# EAGLE schematic pearwatch-TOP (EAGLE 9.5.2)
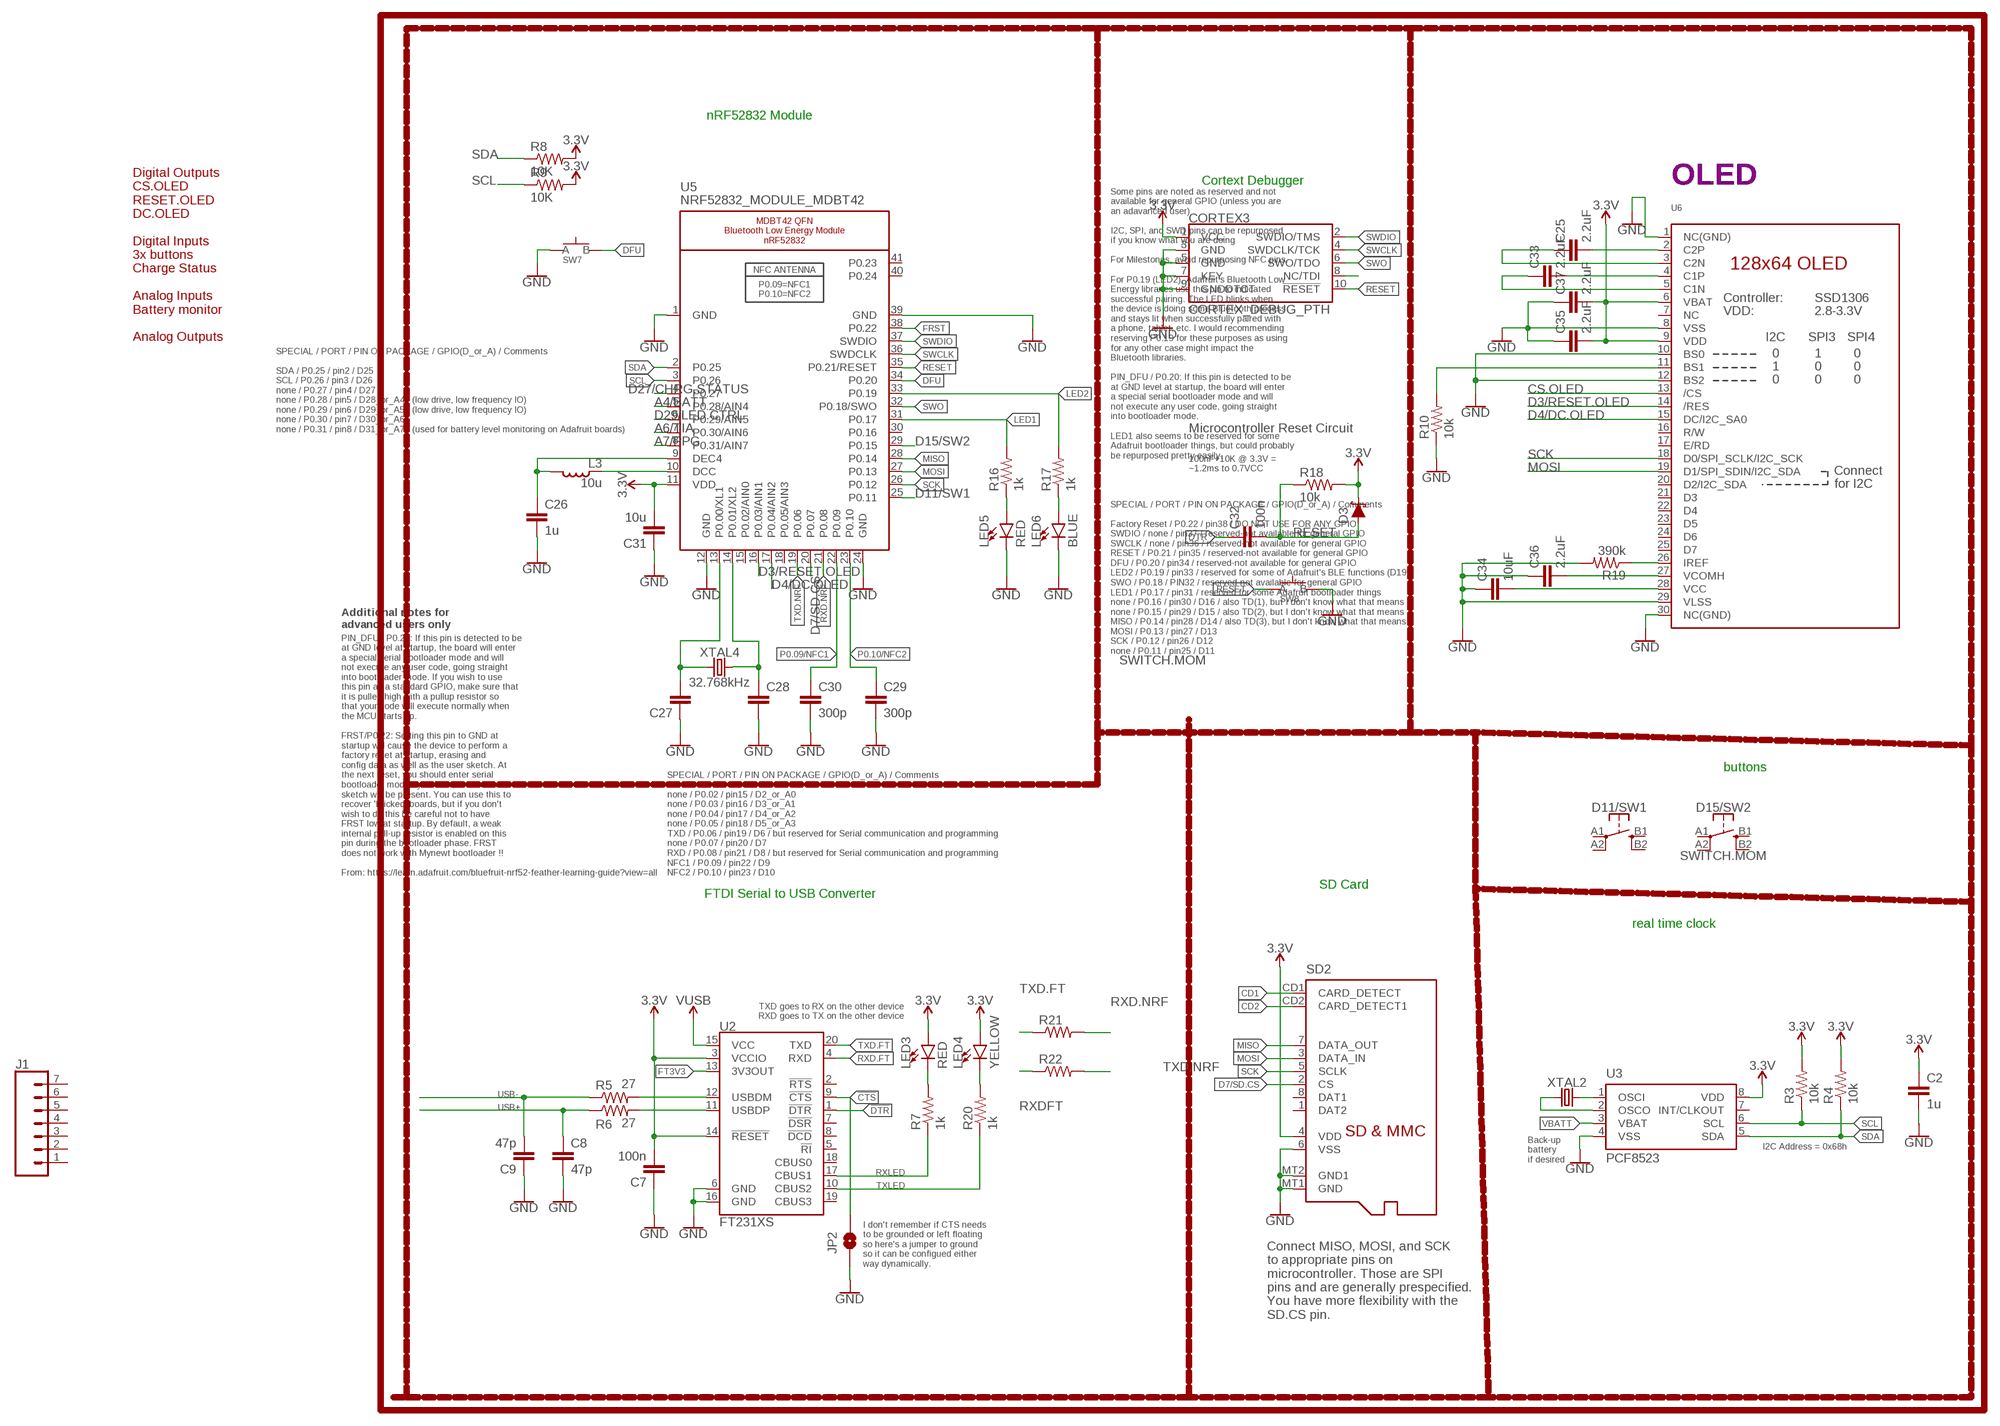
[diagram p0: schematic, sheet 1]

## Parts
C2  1u  CAPACITOR0603  [C0603]
C7  100n  CAPACITOR0603  [C0603]
C8  47p  CAPACITOR0603  [C0603]
C9  47p  CAPACITOR0603  [C0603]
C25  2.2uF  CAPACITOR0402  [C0402]
C26  1u  CAPACITOR0603  [C0603]
C27  CAPACITOR0603  [C0603]
C28  CAPACITOR0603  [C0603]
C29  300p  CAPACITOR0603  [C0603]
C30  300p  CAPACITOR0603  [C0603]
C31  10u  CAPACITOR0805  [C0805]
C32  100n  CAPACITOR0603  [C0603]
C33  2.2uF  CAPACITOR0402  [C0402]
C34  10uF  CAPACITOR0603  [C0603]
C35  2.2uF  CAPACITOR0402  [C0402]
C36  2.2uF  CAPACITOR0402  [C0402]
C37  2.2uF  CAPACITOR0402  [C0402]
CORTEX3  CORTEX_DEBUG_PTH  [2X5-PTH-1.27MM]
D3  SCHOTTKY-USC  [USC]
D11/SW1  SWITCH.MOM  [TACTILE_SWITCH_SMD_6.2MM_TALL]
D15/SW2  SWITCH.MOM  [TACTILE_SWITCH_SMD_6.2MM_TALL]
J1  CONN_07  [1X07]
JP2  JUMPER-SMT_2_NO_SILK  [SMT-JUMPER_2_NO_SILK]
L3  10u  INDUCTOR0603  [L0603]
LED3  RED  LED0603  [LED-0603]
LED4  YELLOW  LED0603  [LED-0603]
LED5  RED  LED0603  [LED-0603]
LED6  BLUE  LED0603  [LED-0603]
R3  10k  RESISTOR0603  [R0603]
R4  10k  RESISTOR0603  [R0603]
R5  27  RESISTOR0603  [R0603]
R6  27  RESISTOR0603  [R0603]
R7  1k  RESISTOR0603  [R0603]
R8  10K  RESISTOR0603  [R0603]
R9  10K  RESISTOR0603  [R0603]
R10  10k  RESISTOR0603  [R0603]
R16  1k  RESISTOR0603  [R0603]
R17  1k  RESISTOR0603  [R0603]
R18  10k  RESISTOR0603  [R0603]
R19  390k  RESISTOR0603  [R0603]
R20  1k  RESISTOR0603  [R0603]
R21  RESISTOR0603  [R0603]
R22  RESISTOR0603  [R0603]
SD2  MICROSD  [MICROSD]
SW7  SPST-PTS830GG140-COPY.1-3  [BUTTON-GULLWING]
SW8  SPST-PTS830GG140-COPY.1-3  [BUTTON-GULLWING]
U2  FT231XS  [SSOP20_L]
U3  PCF8523  [SO8]
U5  NRF52832_MODULE_MDBT42  [BLE_MODULE_RAYTAC_MDBT42]
U6  DISP_OLED_UG-2864HSWEG01-NO-WRAPAROUND  [UG-2864HSWEG01_0.96IN_NO-WRAPAROUND]
XTAL2  32.7680kHz  CRYSTALECS-.327-12.5-12-C-TR  [2-SMD.NOLEAD.2.0MMTO1.2MM]
XTAL4  32.768kHz  CRYSTALECS-.327-12.5-12-C-TR  [2-SMD.NOLEAD.2.0MMTO1.2MM]

## Nets
3.3V: C2.1 C7.2 C31.2 C35.2 C37.2 CORTEX3.1(VCC) D3.-(C) LED3.A LED4.A R3.2 R4.2 R8.2 R9.2 R18.2 SD2.4(VDD) U2.3(VCCIO) U2.14(!RESET) U3.8(VDD) U5.11(VDD) U6.6(VBAT) U6.9(VDD)
!CTS: JP2.2 U2.9(!CTS)
!DTR: U2.1(!DTR)
A4/BATT: U5.5(P0.28/AIN4)
A6/TIA: U5.7(P0.30/AIN6)
A7/PPG: U5.8(P0.31/AIN7)
CD1: SD2.CD1(CARD_DETECT)
CD2: SD2.CD2(CARD_DETECT1)
CS.OLED: U6.13(/CS)
D3/RESET.OLED: U5.16(P0.03/AIN1) U6.14(/RES)
D4/DC.OLED: U5.17(P0.04/AIN2) U6.15(DC/I2C_SA0)
D7/SD.CS: SD2.2(CS) U5.20(P0.07)
D11/SW1: U5.25(P0.11)
D15/SW2: U5.29(P0.15)
D27/CHRG.STATUS: U5.4(P0.27)
D29/LED.CTRL: U5.6(P0.29/AIN5)
DFU: SW7.3(B) U5.34(P0.20)
DTR: C32.1
FRST: U5.38(P0.22)
FT3V3: U2.13(3V3OUT)
GND: C2.2 C7.1 C8.2 C9.1 C26.2 C27.1 C28.2 C29.2 C30.2 C31.1 C34.1 C35.1 C36.1 C37.1 CORTEX3.3(GND) CORTEX3.5(GND) CORTEX3.7(KEY) CORTEX3.9(GNDDTCT) JP2.1 LED5.C LED6.C R10.1 R19.2 SD2.6(VSS) SD2.MT1(GND) SD2.MT2(GND1) SW7.1(A) SW8.3(B) U2.6(GND) U2.16(GND) U3.4(VSS) U5.1(GND) U5.12(GND) U5.24(GND) U5.39(GND) U6.1(NC(GND)) U6.8(VSS) U6.10(BS0) U6.12(BS2) U6.29(VLSS) U6.30(NC(GND))
LED1: R16.2 U5.31(P0.17)
LED2: R17.2 U5.33(P0.19)
MISO: SD2.7(DATA_OUT) U5.28(P0.14)
MOSI: SD2.3(DATA_IN) U5.27(P0.13) U6.19(D1/SPI_SDIN/I2C_SDA)
N$1: U3.2(OSCO) XTAL2.P$1
N$2: U3.1(OSCI) XTAL2.P$2
N$3: R5.2 U2.12(USBDM)
N$6: R6.2 U2.11(USBDP)
N$7: LED3.C R7.2
N$8: LED4.C R20.2
N$18: R10.2 U6.11(BS1)
N$21: R19.1 U6.26(IREF)
N$23: C25.2 U6.2(C2P)
N$26: C27.2 U5.13(P0.00/XL1) XTAL4.P$1
N$27: C28.1 U5.14(P0.01/XL2) XTAL4.P$2
N$28: LED5.A R16.1
N$29: LED6.A R17.1
N$30: L3.1 U5.10(DCC)
N$31: C26.1 L3.2 U5.9(DEC4)
N$32: CORTEX3.8(NC/TDI)
N$33: C25.1 U6.3(C2N)
N$34: C33.2 U6.4(C1P)
N$35: C33.1 U6.5(C1N)
N$36: C34.2 U6.28(VCC)
N$37: C36.2 U6.27(VCOMH)
P0.09/NFC1: C30.1 U5.22(P0.09)
P0.10/NFC2: C29.1 U5.23(P0.10)
RESET: C32.2 CORTEX3.10(!RESET) D3.+(A) R18.1 SW8.1(A) U5.35(P0.21/RESET)
RXD.FT: U2.4(RXD)
RXD.NRF: R21.2 U5.21(P0.08)
RXDFT: R22.1
RXLED: R7.1 U2.17(CBUS1)
SCK: SD2.5(SCLK) U5.26(P0.12) U6.18(D0/SPI_SCLK/I2C_SCK)
SCL: R3.1 R9.1 U3.6(SCL) U5.3(P0.26)
SDA: R4.1 R8.1 U3.5(SDA) U5.2(P0.25)
SWCLK: CORTEX3.4(SWDCLK/TCK) U5.36(SWDCLK)
SWDIO: CORTEX3.2(SWDIO/TMS) U5.37(SWDIO)
SWO: CORTEX3.6(SWO/TDO) U5.32(P0.18/SWO)
TXD.FT: R21.1 U2.20(TXD)
TXD.NRF: R22.2 U5.19(P0.06)
TXLED: R20.1 U2.10(CBUS2)
USB+: C8.1 R6.1
USB-: C9.2 R5.1
V_USB: U2.15(VCC) ; supply symbol labelled VUSB
VBATT: U3.3(VBAT)
Unconnected: D11/SW1.A1 D11/SW1.A2 D11/SW1.B1 D11/SW1.B2 D15/SW2.A1 D15/SW2.A2 D15/SW2.B1 D15/SW2.B2 J1.1 J1.2 J1.3 J1.4 J1.5 J1.6 J1.7 SD2.1(DAT2) SD2.8(DAT1) U2.2(!RTS) U2.5(!RI) U2.7(!DSR) U2.8(!DCD) U2.18(CBUS0) U2.19(CBUS3) U3.7(INT/CLKOUT) U5.15(P0.02/AIN0) U5.18(P0.05/AIN3) U5.30(P0.16) U5.40(P0.24) U5.41(P0.23) U6.7(NC) U6.16(R/W) U6.17(E/RD) U6.20(D2/I2C_SDA) U6.21(D3) U6.22(D4) U6.23(D5) U6.24(D6) U6.25(D7)

## Notes on the sheet
- nRF52832 Module
- Cortext Debugger | OLED
- Digital Outputs
  CS.OLED 
  RESET.OLED 
  DC.OLED
  
  Digital Inputs
  3x buttons
  Charge Status
  
  Analog Inputs
  Battery monitor
  
  Analog Outputs
- SPECIAL / PORT / PIN ON PACKAGE / GPIO(D_or_A) / Comments
  
  SDA / P0.25 / pin2 / D25
  SCL / P0.26 / pin3 / D26
  none / P0.27 / pin4 / D27
  none / P0.28 / pin5 / D28_or_A4 / (low drive, low frequency IO)
  none / P0.29 / pin6 / D29_or_A5 / (low drive, low frequency IO)
  none / P0.30 / pin7 / D30_or_A6
  none / P0.31 / pin8 / D31_or_A7 / (used for battery level monitoring on Adafruit boards)
- Microcontroller Reset Circuit
- Some pins are noted as reserved and not
  available for general GPIO (unless you are
  an adavanced user)
  
  I2C, SPI, and SWD pins can be repurposed
  if you know what you are doing
  
  For Milestones, avoid repurposing NFC pins.
  
  For P0.19 (LED2), Adafruit's Bluetooth Low
  Energy libraries use this pin to indicated
  successful pairing. The LED blinks when
  the device is doing some Bluetooth process
  and stays lit when successfully paired with
  a phone, tablet, etc. I would recommending
  reserving P0.19 for these purposes as using
  for any other case might impact the
  Bluetooth libraries.
  
  PIN_DFU / P0.20: If this pin is detected to be
  at GND level at startup, the board will enter
  a special serial bootloader mode and will
  not execute any user code, going straight
  into bootloader mode.
  
  LED1 also seems to be reserved for some
  Adafruit bootloader things, but could probably
  be repurposed pretty easily.
- 100nF+10K @ 3.3V =
  ~1.2ms to 0.7VCC
- Additional notes for
  advanced users only
- SPECIAL / PORT / PIN ON PACKAGE / GPIO(D_or_A) / Comments
  
  Factory Reset / P0.22 / pin38 / DO NOT USE FOR ANY GPIO
  SWDIO / none / pin37 / reserved-not available for general GPIO
  SWCLK / none / pin36 / reserved-not available for general GPIO
  RESET / P0.21 / pin35 / reserved-not available for general GPIO
  DFU / P0.20 / pin34 / reserved-not available for general GPIO
  LED2 / P0.19 / pin33 / reserved for some of Adafruit's BLE functions (D19)
  SWO / P0.18 / PIN32 / reserved-not available for general GPIO
  LED1 / P0.17 / pin31 / reserved for some Adafruit bootloader things
  none / P0.16 / pin30 / D16 / also TD(1), but I don't know what that means
  none / P0.15 / pin29 / D15 / also TD(2), but I don't know what that means
  MISO / P0.14 / pin28 / D14 / also TD(3), but I don't know what that means
  MOSI / P0.13 / pin27 / D13
  SCK / P0.12 / pin26 / D12
  none / P0.11 / pin25 / D11
- buttons
- PIN_DFU / P0.20: If this pin is detected to be
  at GND level at startup, the board will enter
  a special serial bootloader mode and will
  not execute any user code, going straight
  into bootloader mode. If you wish to use
  this pin as a standard GPIO, make sure that
  it is pulled high with a pullup resistor so
  that your code will execute normally when
  the MCU starts up.
  
  FRST/P0.22: Setting this pin to GND at
  startup will cause the device to perform a
  factory reset at startup, erasing and
  config data as well as the user sketch. At
  the next reset, you should enter serial
  bootloader mode by default, since no user
  sketch will be present. You can use this to
  recover 'bricked' boards, but if you don't
  wish to do this be careful not to have
  FRST low at startup. By default, a weak
  internal pull-up resistor is enabled on this
  pin during the bootloader phase. FRST
  does not work with Mynewt bootloader !!
  
  From: https://learn.adafruit.com/bluefruit-nrf52-feather-learning-guide?view=all
- SPECIAL / PORT / PIN ON PACKAGE / GPIO(D_or_A) / Comments
  
  none / P0.02 / pin15 / D2_or_A0
  none / P0.03 / pin16 / D3_or_A1
  none / P0.04 / pin17 / D4_or_A2
  none / P0.05 / pin18 / D5_or_A3
  TXD / P0.06 / pin19 / D6 / but reserved for Serial communication and programming
  none / P0.07 / pin20 / D7
  RXD / P0.08 / pin21 / D8 / but reserved for Serial communication and programming
  NFC1 / P0.09 / pin22 / D9
  NFC2 / P0.10 / pin23 / D10
- FTDI Serial to USB Converter | SD Card
- real time clock
- TXD goes to RX on the other device
  RXD goes to TX on the other device
- I2C Address = 0x68h
- Back-up
  battery
  if desired
- I don't remember if CTS needs
  to be grounded or left floating
  so here's a jumper to ground
  so it can be configued either
  way dynamically.
- Connect MISO, MOSI, and SCK
  to appropriate pins on
  microcontroller. Those are SPI
  pins and are generally prespecified.
  You have more flexibility with the
  SD.CS pin.

## Library data of the parts
C2 C7-C9 C25-C37 = LinnesLab-Passives:CAPACITOR
CORTEX3 = LinnesLab-Connectors:CORTEX_DEBUG: Cortex Debug Connector - 10 pin Supports JTAG debug, Serial Wire debug, and Serial Wire Viewer. PTH and SMD connector options available. General Connector Information <http://infocenter.arm.com/help/topic/com.arm.doc.faqs/attached/13634/cortex_debug_connectors.pdf> Products: PTH Connector <http://www.digikey.com/product-detail/en/cnc-tech/3220-10-0100-00/1175-1627-ND/3883661> -via Digi-Key SparkFun PSoc <https://www.sparkfun.com/products/13229> SparkFun T <https://www.sparkfun.com/products/13810>
D3 = LinnesLab-DiscreteSemi:SCHOTTKY: Schottky diode A Schottky diode is a semiconductor diode which has a low forward voltage drop and a very fast switching action. Example: Digi-Key Part Number: RB161MM-20CT-ND
D11/SW1 D15/SW2 = LinnesLab-Switches:SWITCH.MOM: PTS645SM43SMTR92 LFS
J1 = LinnesLab-Connectors:CONN_07: Multi connection point. Often used as Generic Header-pin footprint for 0.1 inch spaced/style header connections On any of the 0.1 inch spaced packages, you can populate with these: Break Away Headers - Straight <https://www.sparkfun.com/products/116> (PRT-00116) Break Away Male Headers - Right Angle <https://www.sparkfun.com/products/553> (PRT-00553) Female Headers <https://www.sparkfun.com/products/115> (PRT-00115) Break Away Headers - Machine Pin <https://www.sparkfun.com/products/117> (PRT-00117) Break Away Female Headers - Swiss Machine Pin <https://www.sparkfun.com/products/743> (PRT-00743) For SCREWTERMINALS and SPRING TERMINALS visit here: Screw Terimnals on SparkFun.com <https://www.sparkfun.com/search/results?term=Screw+Terminals> (5mm/3.5mm/2.54mm spacing) This device is also useful as a general connection point to wire up your design to another part of your project. Our various solder wires solder well into these plated through hole pads. Hook-Up Wire - Assortment (Stranded, 22 AWG) <https://www.sparkfun.com/products/11375> (PRT-11375) Hook-Up Wire - Assortment (Solid Core, 22 AWG) <https://www.sparkfun.com/products/11367> (PRT-11367) View the entire wire category on our website here <https://www.sparkfun.com/categories/141> Special notes: Molex polarized connector foot print use with SKU : PRT-08231 with associated crimp pins and housings. 1MM SMD Version SKU: PRT-10208 NOTES ON THE VARIANTS LOCK and LOCK_LONGPADS... This footprint was designed to help hold the alignment of a through-hole component (i.e. 6-pin header) while soldering it into place. You may notice that each hole has been shifted either up or down by 0.005 of an inch from it's more standard position (which is a perfectly straight line). This slight alteration caused the pins (the squares in the middle) to touch the edges of the holes. Because they are alternating, it causes a "brace" to hold the component in place. 0.005 has proven to be the perfect amount of "off-center" position when using our standard breakaway headers. Although looks a little odd when you look at the bare footprint, once you have a header in there, the alteration is very hard to notice. Also,if you push a header all the way into place, it is covered up entirely on the bottom side.
JP2 = LinnesLab-Switches:JUMPER-SMT_2_NO: Normally open jumper This jumper has two pads in close proximity to each other. Apply solder to close the connection. Round pads are easier to solder for beginners, but are a lot larger. SparkFun Product that uses the round pads: SparkFun EL Sequencer <https://www.sparkfun.com/products/12781>
L3 = LinnesLab-Passives:INDUCTOR
LED3-LED6 = LinnesLab-LED:LED: LED (Generic) Standard schematic elements and footprints for 5mm, 3mm, 1206, and 0603 sized LEDs. Generic LEDs with no color specified. LTST-C190KGKT: arrow indicates cathode
R3-R10 R16-R22 = LinnesLab-Passives:RESISTOR
SD2 = LinnesLab-Connectors:MICROSD: Micro-SD / Transflash card holder with SPI pinout For the 3M # 2908-05WB-MG and/or 4UCON #19656 push-push type
SW7 SW8 = LinnesLab-Switches:SPST-PTS830GG140-COPY
U2 = LinnesLab-DigitalIC:FT231X: FTDI FT231X Full Speed USB to Full-handshake UART This USB2.0 Full Speed IC offers a compact bridge to full handshake UART interfaces. The device is a UART, capable of operating up to 3MBaud, with low power consumption (8mA). The FT231X includes the complete FT-X series feature set and enables USB to be added into a system design quickly and easily over a UART interface. Datasheet <http://cdn.sparkfun.com/datasheets/Components/General%20IC/DS_FT231X.pdf>; DIGIKEY: 768-1156-5-ND; MFN: FT231XS-U
U3 = LinnesLab-Clocks:PCF8523; DIGIKEY: 568-5306-1-ND; I2C_ADDRESS: 0x68h; MFN: PCF8523T/1,118; MFN_MANUFACTURER: NXP USA Inc.
U5 = LinnesLab-Microcontrollers:NRF52832_MODULE_MDBT42: MDBT42 - BLE Module (nRF52832 QFN) VDD: 1.7-3.6V
U6 = LinnesLab-Displays:DISP_OLED_UG-2864HSWEG01: UG-2864HSWEG01 OLED display Both 1.3" and 0.96" models share the same FPC tab footprint, only the screen dimensions vary.
XTAL2 XTAL4 = LinnesLab-Clocks:CRYSTAL; DIGIKEY: XC2288CT-ND; FREQ: 32.7680KHZ; LOAD_CAP: 12.5pF